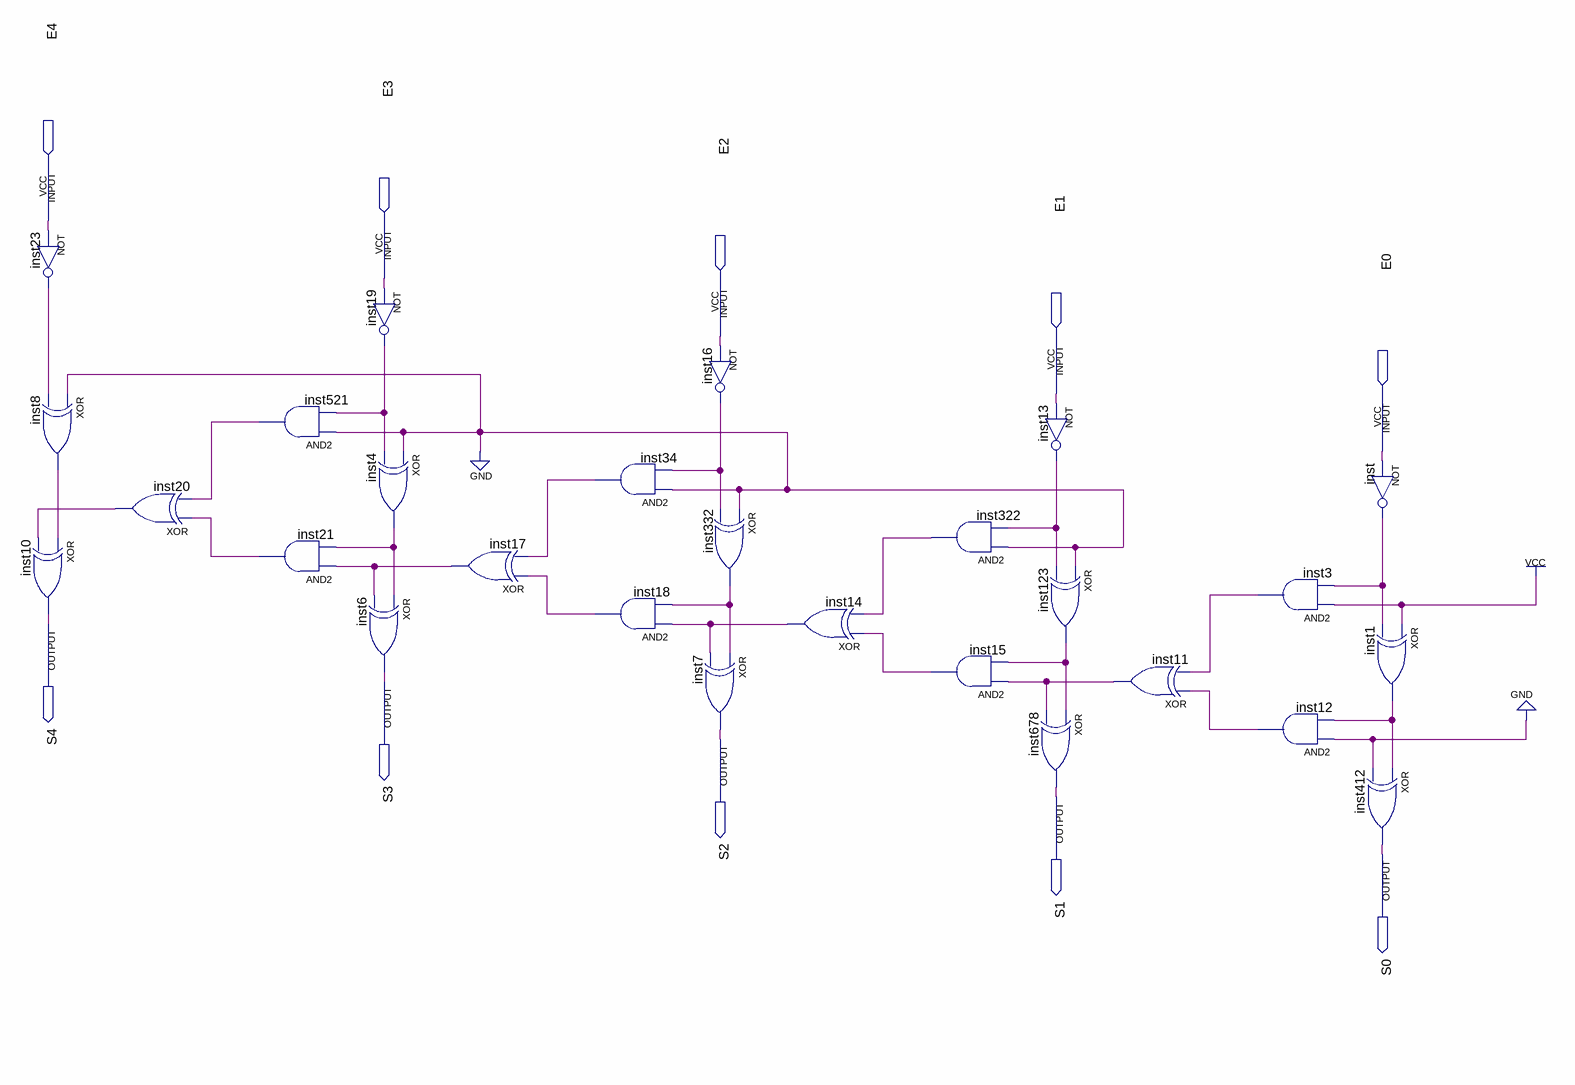
[diagram p0: schematic sheet]
// Quartus schematic Conversor.bdf as structural Verilog: 27 symbols, 10 pins
module Conversor (
  input  E4,
  input  E3,
  input  E2,
  input  E1,
  input  E0,
  output S4,
  output S3,
  output S2,
  output S1,
  output S0
);

  wire inst1_out, inst3_out, inst4_out, inst8_out, inst11_out, inst12_out, inst13_out, inst14_out,
       inst15_out, inst16_out, inst17_out, inst18_out, inst19_out, inst20_out, inst21_out, inst23_out,
       inst34_out, inst123_out, inst322_out, inst332_out, inst521_out, inst_out;

  not inst23 (inst23_out, E4);
  xor inst8 (inst8_out, 1'b0, inst23_out);
  xor inst10 (S4, inst8_out, inst20_out);
  xor inst20 (inst20_out, inst21_out, inst521_out);
  and inst521 (inst521_out, 1'b0, inst19_out);
  and inst21 (inst21_out, inst17_out, inst4_out);
  not inst19 (inst19_out, E3);
  xor inst4 (inst4_out, 1'b0, inst19_out);
  xor inst6 (S3, inst4_out, inst17_out);
  xor inst17 (inst17_out, inst18_out, inst34_out);
  and inst34 (inst34_out, 1'b0, inst16_out);
  and inst18 (inst18_out, inst14_out, inst332_out);
  not inst16 (inst16_out, E2);
  xor inst332 (inst332_out, 1'b0, inst16_out);
  xor inst7 (S2, inst332_out, inst14_out);
  xor inst14 (inst14_out, inst15_out, inst322_out);
  and inst322 (inst322_out, 1'b0, inst13_out);
  and inst15 (inst15_out, inst11_out, inst123_out);
  xor inst678 (S1, inst123_out, inst11_out);
  not inst13 (inst13_out, E1);
  xor inst123 (inst123_out, 1'b0, inst13_out);
  xor inst11 (inst11_out, inst12_out, inst3_out);
  and inst3 (inst3_out, 1'b1, inst_out);
  and inst12 (inst12_out, 1'b0, inst1_out);
  not inst (inst_out, E0);
  xor inst1 (inst1_out, 1'b1, inst_out);
  xor inst412 (S0, inst1_out, 1'b0);
endmodule
